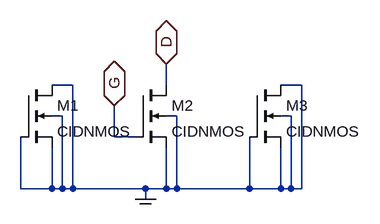
[diagram p0: schematic Unidad_N.asc]
Unidad_N.asc, the LTspice schematic file:
Version 4.1
SHEET 1 880 680
WIRE 96 96 64 96
WIRE 240 96 240 64
WIRE 448 96 416 96
WIRE 80 144 64 144
WIRE 256 144 240 144
WIRE 432 144 416 144
WIRE 160 176 160 128
WIRE 192 176 160 176
WIRE 16 256 16 176
WIRE 64 256 64 192
WIRE 64 256 16 256
WIRE 80 256 80 144
WIRE 80 256 64 256
WIRE 96 256 96 96
WIRE 96 256 80 256
WIRE 208 256 96 256
WIRE 240 256 240 192
WIRE 240 256 208 256
WIRE 256 256 256 144
WIRE 256 256 240 256
WIRE 368 256 368 176
WIRE 368 256 256 256
WIRE 416 256 416 192
WIRE 416 256 368 256
WIRE 432 256 432 144
WIRE 432 256 416 256
WIRE 448 256 448 96
WIRE 448 256 432 256
WIRE 208 272 208 256
FLAG 208 272 COM
IOPIN 208 272 BiDir
FLAG 160 128 G
IOPIN 160 128 BiDir
FLAG 240 64 D
IOPIN 240 64 BiDir
SYMBOL nmos4 16 96 R0
SYMATTR InstName M1
SYMATTR Value CIDNMOS
SYMATTR Value2 l=10u w=100u
SYMBOL nmos4 192 96 R0
SYMATTR InstName M2
SYMATTR Value CIDNMOS
SYMATTR Value2 l=10u w=100u
SYMBOL nmos4 368 96 R0
SYMATTR InstName M3
SYMATTR Value CIDNMOS
SYMATTR Value2 l=10u w=100u

The netlist it stands for:
* Unidad_N.asc
M1 COM COM COM COM CIDNMOS l=10u w=100u
M2 D G COM COM CIDNMOS l=10u w=100u
M3 COM COM COM COM CIDNMOS l=10u w=100u
.model NMOS NMOS
.model PMOS PMOS
.lib standard.mos
.backanno
.end